# Altium schematic sheet 03-Offset_et_PBF.SchDoc
size 431 x 279 mm; SheetNumber: 1; SheetTotal: 1; ENG_APP_DATE: --/--/--; DSN_APP_DATE: --/--/--; CHK_APP_DATE: --/--/--
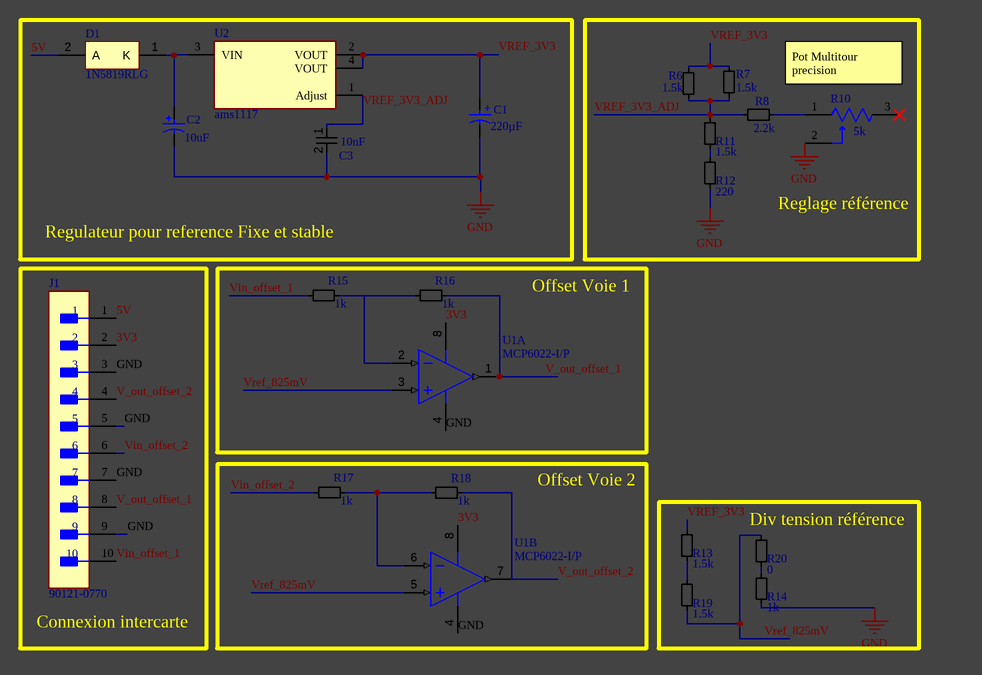
[diagram p0: 03-Offset_et_PBF.SchDoc]

## Parts
C1  Capacitance: 220µF  [WCAP-ATG5_D6.3H11]  (hidden comment: 860020373010)
C2  Capacitance: 10uF  [CAPPR55-200-1100X500X1200]  (hidden comment: ECA1HM100)
C3  value 10nF  [Cap_6.0%2A2.5%2A6mm]  (hidden comment: Cap_6.0*2.5*6mm)
D1  1N5819RLG  [ONSC-AXIAL_LEAD-2-59-10_P]
J1  90121-0770  [FP-90121-0770-MFG]
R6  value 1.5k  [Res_Axial_3.5x6.5mm_TH]  (hidden comment: Res_3.5x6.5mm_TH)
R7  value 1.5k  [Res_Axial_3.5x6.5mm_TH]  (hidden comment: Res_3.5x6.5mm_TH)
R8  value 2.2k  [Res_Axial_3.5x6.5mm_TH]  (hidden comment: Res_3.5x6.5mm_TH)
R10  Resistance: 5k  [FP-3006P-1-104LF-MFG]  (hidden comment: 3006P-1-104LF)
R11  value 1.5k  [Res_Axial_3.5x6.5mm_TH]  (hidden comment: Res_3.5x6.5mm_TH)
R12  value 220  [Res_Axial_3.5x6.5mm_TH]  (hidden comment: Res_3.5x6.5mm_TH)
R13  value 1.5k  [Res_Axial_3.5x6.5mm_TH]  (hidden comment: Res_3.5x6.5mm_TH)
R14  value 1k  [Res_Axial_3.5x6.5mm_TH]  (hidden comment: Res_3.5x6.5mm_TH)
R15  value 1k  [Res_Axial_3.5x6.5mm_TH]  (hidden comment: Res_3.5x6.5mm_TH)
R16  value 1k  [Res_Axial_3.5x6.5mm_TH]  (hidden comment: Res_3.5x6.5mm_TH)
R17  value 1k  [Res_Axial_3.5x6.5mm_TH]  (hidden comment: Res_3.5x6.5mm_TH)
R18  value 1k  [Res_Axial_3.5x6.5mm_TH]  (hidden comment: Res_3.5x6.5mm_TH)
R19  value 1.5k  [Res_Axial_3.5x6.5mm_TH]  (hidden comment: Res_3.5x6.5mm_TH)
R20  value 0  [Res_Axial_3.5x6.5mm_TH]  (hidden comment: Res_3.5x6.5mm_TH)
U1  MCP6022-I/P  [PDIP300-P8]  (parts A,B of 2)
U2  ams1117  [FP-ams1117-IPC_C]

## Blocks framed on the sheet
Regulateur pour reference Fixe et stable: C1-C3 D1 U2
Reglage référence: R6-R8 R10-R12
Connexion intercarte: J1
Offset Voie 1: R15 R16 U1
Offset Voie 2: R17 R18 U1
Div tension référence: R13 R14 R19 R20

## Nets
GND: C1.2(N) C2.2 C3.2 J1.3 J1.5 J1.7 J1.9 R10.2(WIPER) R12.1 R14.1 U1.4(VSS)
3V3: J1.2 U1.8(VDD)
5V: D1.2(A) J1.1
V_out_offset_1: J1.8 R16.1 U1.1(VOUTA)
V_out_offset_2: J1.4 R18.1 U1.7(VOUTB)
Vin_offset_1: J1.10 R15.0
Vin_offset_2: J1.6 R17.0
VREF_3V3: C1.1(P) R6.0 R7.0 R13.0 U2.2(VOUT) U2.4(VOUT)
VREF_3V3_ADJ: C3.1 R6.1 R7.1 R8.1 R11.0 U2.1(Adjust)
Vref_825mV: R19.1 R20.0 U1.3(VINA+) U1.5(VINB+)
NetC2_1: C2.1 D1.1(K) U2.3(VIN)
NetR8_0: R8.0 R10.1(CCW)
NetR11_1: R11.1 R12.0
NetR13_1: R13.1 R19.0
NetR14_0: R14.0 R20.1
NetR15_1: R15.1 R16.0 U1.2(VINA-)
NetR17_1: R17.1 R18.0 U1.6(VINB-)

Not connected (* = marked no-connect by the designer): R10 3(CW)*

## Notes on the sheet
- Pot Multitour precision
- DWG. NO.
- REV.
- SHT.
- THIS DOCUMENT AND THE DATA DISCLOSED HEREIN OR HEREWITH IS THE PROPERTY OF ALTIUM LIMITED AND MAY BE FREELY DISTRIBUTED IN WHOLE. NO RIGHTS ARE RESERVED OR EXPRESS OR IMPLIED WARANTEE GIVEN.
- REVISION
- DESCRIPTION
- DATE
- APPROVED
- ENG:
- APPROVALS
- PROJECT
- DSN:
- CHK:
- REFERENCE DOCUMENTS
- PROJECT REVISION:
- TITLE
- DOCUMENT REVISION:
- DESIGN ITEM:
- BOM:
- FAB DWG:
- PCB DWG:
- ASSY DWG:
- SCALE:
- SIZE
- B
- CAGE CODE
- FILE NAME
- DWG NO.
- SHEET
- OF
- REV
- (in symbol CMP-03913-53914174-1) +

## Library data of the parts
C1 = CMP-03913-53914174-1: 860020373010 WCAP-ATG5 Aluminum Electrolytic Capacitors; Voltage Rating: 16V; Leakage Current: 35.2µA; Ripple Current: 215mA; Polarity: Polar; Tolerance: 20%; Pitch: 2.5mm; Life (Hours): 2000hours; NexarPartId: 53914174; Mount: Through Hole; Length: 11mm; Min Operating Temperature: -40°C; Max Operating Temperature: 105°C; Diameter: 6.3mm; Height - Seated (Max): 12.4968mm; Case/Package: Radial; Packaging: Tape & Box (TB); RoHS: Compliant; Lead Pitch: 2.4892mm
C2 = CMP-1665-00038-2: Aluminum Electrolytic Capacitor, 10 uF, +/- 20%, 50 V, -40 to 85 degC, 2-Pin THD, RoHS, Bulk; Manufacturer: Panasonic; Life (Hours): 2000Hour; Lead/Base Style: Straight; Dissipation Factor: 0.12%; Leakage Current: 3uA; Dielectric Material: Aluminium; Lead Diameter: 0.5mm; Voltage Rating: 50V; Ripple Current: 65mA; Package Reference: CAPPR55-200-1100X500X1200; Height: 11mm; Diameter: 5mm; REACH SVHC: NoSVHC; Mount: ThroughHole; Packaging: Bulk; Manufacturer URL: http://www.panasonic.com/; Termination: Radial; Datasheet URL: https://industrial.panasonic.com/cdbs/www-data/pdf/RDF0000/ABA0000C1218.pdf; Lead Free: LeadFree; Height - Seated (Max): 0.472inch; Case/Package: Radial; Package Description: 2-Pin Radial Lead, Dia 5 mm, Height 12 mm; Tolerance: 20%; Datasheet Version: Rev. 05, 10/2016; Package Quantity: 200; Ripple Current (AC): 65mA; Min Operating Temperature: -40degC; RoHSCompliant: true; Number of Pins: 2; Max Operating Temperature: 85degC; Voltage: 50V; Lead Pitch: 2mm; Radiation Hardening: No; Voltage Rating (DC): 50V; Length: 11mm
D1 = CMP-1055-00037-1: Rectifier, 2-Pin Axial_Lead, Pb-Free, Tape and Reel; Manufacturer: On Semiconductor; IFSM Max (A): 25; Configuration: Single; ComponentLink1Description: Manufacturer URL; PackageReference: AXIAL_LEAD-2-59-10; RoHS: TRUE; PackageVersion: Rev. U, 02/2005; Mounting Technology: Through Hole; ComponentLink3URL: http://www.onsemi.cn/pub_link/Collateral/59-10.PDF; ComponentLink3Description: Package Specification; PackageDescription: 2-Pin, Axial Lead, Diameter 2.35 mm; ComponentLink2Description: Datasheet; ComponentLink1URL: http://www.onsemi.com/; Packing: Tape and Reel; DatasheetVersion: Rev. 10; ComponentLink2URL: http://www.onsemi.cn/pub_link/Collateral/1N5817-D.PDF; PartNumber: 1N5819RLG
J1 = CMP-04776-001047-1: CONN HEADER R/A 10POS 2.54MM; Voltage Rating: 350V; Current Rating: 3A; Number of Positions: 10; Glow Wire Compliant: Non-compliant; Gender: Male; Number of Circuits: 9; Insulation Resistance: 5GR; Connector Type: Male Pin; Contact Resistance: 20mR; System: Connector; Contact Material: Brass; Voltage Rating (AC): 350V; Housing Material: Polyester; Min Operating Temperature: -55°C; Termination: Solder; Material: Glass; Lead Free: Lead Free; Packaging: Bulk; Pitch: 2.54mm; Mount: Through Hole; Number of Poles: 10; RoHS Compliant: Yes; Working Voltage: 350V; Contact Plating: Gold; Contact Type: Male Pin; Package Quantity: 1; Series: C-Grid III™ 90121; Lead Pitch: 2.54mm; Radiation Hardening: No; Max Operating Temperature: 125°C; Number of Contacts: 10; Housing Color: Black; Orientation: Right Angle; Number of Rows: 1; Color: Black; Contact Mating Length: 0.266inch
R10 = CMP-07234-000037-1: TRIMMER 100K OHM 0.75W PC PIN; Manufacturer Series: 3006; Resistance Law: Linear; Tolerance: 10%; Insulation Resistance: 1GR; Number of Terminals/Pins: 3; Pitch: 2.5mm; Temperature Coefficient: 100ppm/°C; Power Rating: 750mW; Actuator Orientation: Horizontal; Number of Turns: 15; Actuator Type: SCREW; Pin Diameter: 0.6mm; Terminal Finish: Tin; Number of Pins: 3; Packaging: Rail/Tube; Package Quantity: 100; RoHS Compliant: Yes; Technology: CERMET; Termination: Pin; Depth: 4.83mm; REACH SVHC: No SVHC; Military Standard: Not; Taper: Linear; Min Operating Temperature: -55°C; Series: 3006; Length: 20.57mm; Lead Free: Contains Lead; Max Power Dissipation: 750mW; Height: 6.35mm; Mount: Through Hole; Type: Potentiometer; Max Operating Temperature: 125°C; Weight: 0.04oz; Color: Blue; Resistor Type: Cermet; Width: 4.83mm; Radiation Hardening: No; Thickness: 5.59mm; Resistance Tolerance: 10%
U1 = CMP-0187-00094-3: None; Max Output Current: 30mA; Max Supply Voltage: 5.5V; Input Offset Voltage (Vos): 500uV; Bandwidth: 10MHz; Max Input Voltage: 5.8V; Number of Elements: 2; Supply Current: 1mA; Row Spacing: 9.4mm; Max Frequency: 10kHz; Common Mode Rejection Ratio: 70dB; Min Supply Voltage: 2.5V; Input Bias Current: 150pA; Min Input Voltage: -300mV; Slew Rate-Nom: 7V/µs; Max Supply Current: 2mA; Voltage Gain: 110dB; Settling Time: 250ns; Power Supply Rejection Ratio (PSRR): 74dB; Output Current: 22mA; Amplifier Type: GENERAL PURPOSE; Case/Package: PDIP; Number of Pins: 8; Lead Pitch: 2.54mm; Radiation Hardening: No; Min Operating Temperature: -40°C; Number of Amplifiers: 2; Number of Channels: 2; Nominal Supply Current: 1mA; Gain Bandwidth Product: 10MHz; Mount: Through Hole; Technology: CMOS; REACH SVHC: No SVHC; Length: 0.4inch; Number of Circuits: 2; Height: 0.195inch; Lead Free: Lead Free; Max Operating Temperature: 85°C; Packaging: Rail/Tube; Width: 0.28inch; Unity Gain Bandwidth Product: 10MHz; Input Offset Voltage-Max: 500uV; Package Quantity: 60; Slew Rate: 7V/µs; RoHS Compliant: Yes
U2 = CMP-209535-000002-1: 1A LOW DROPOUT VOLTAGE REGULATOR; RoHS Compliant: Yes